# EAGLE design ESP07_Multi (EAGLE 7.3.0)
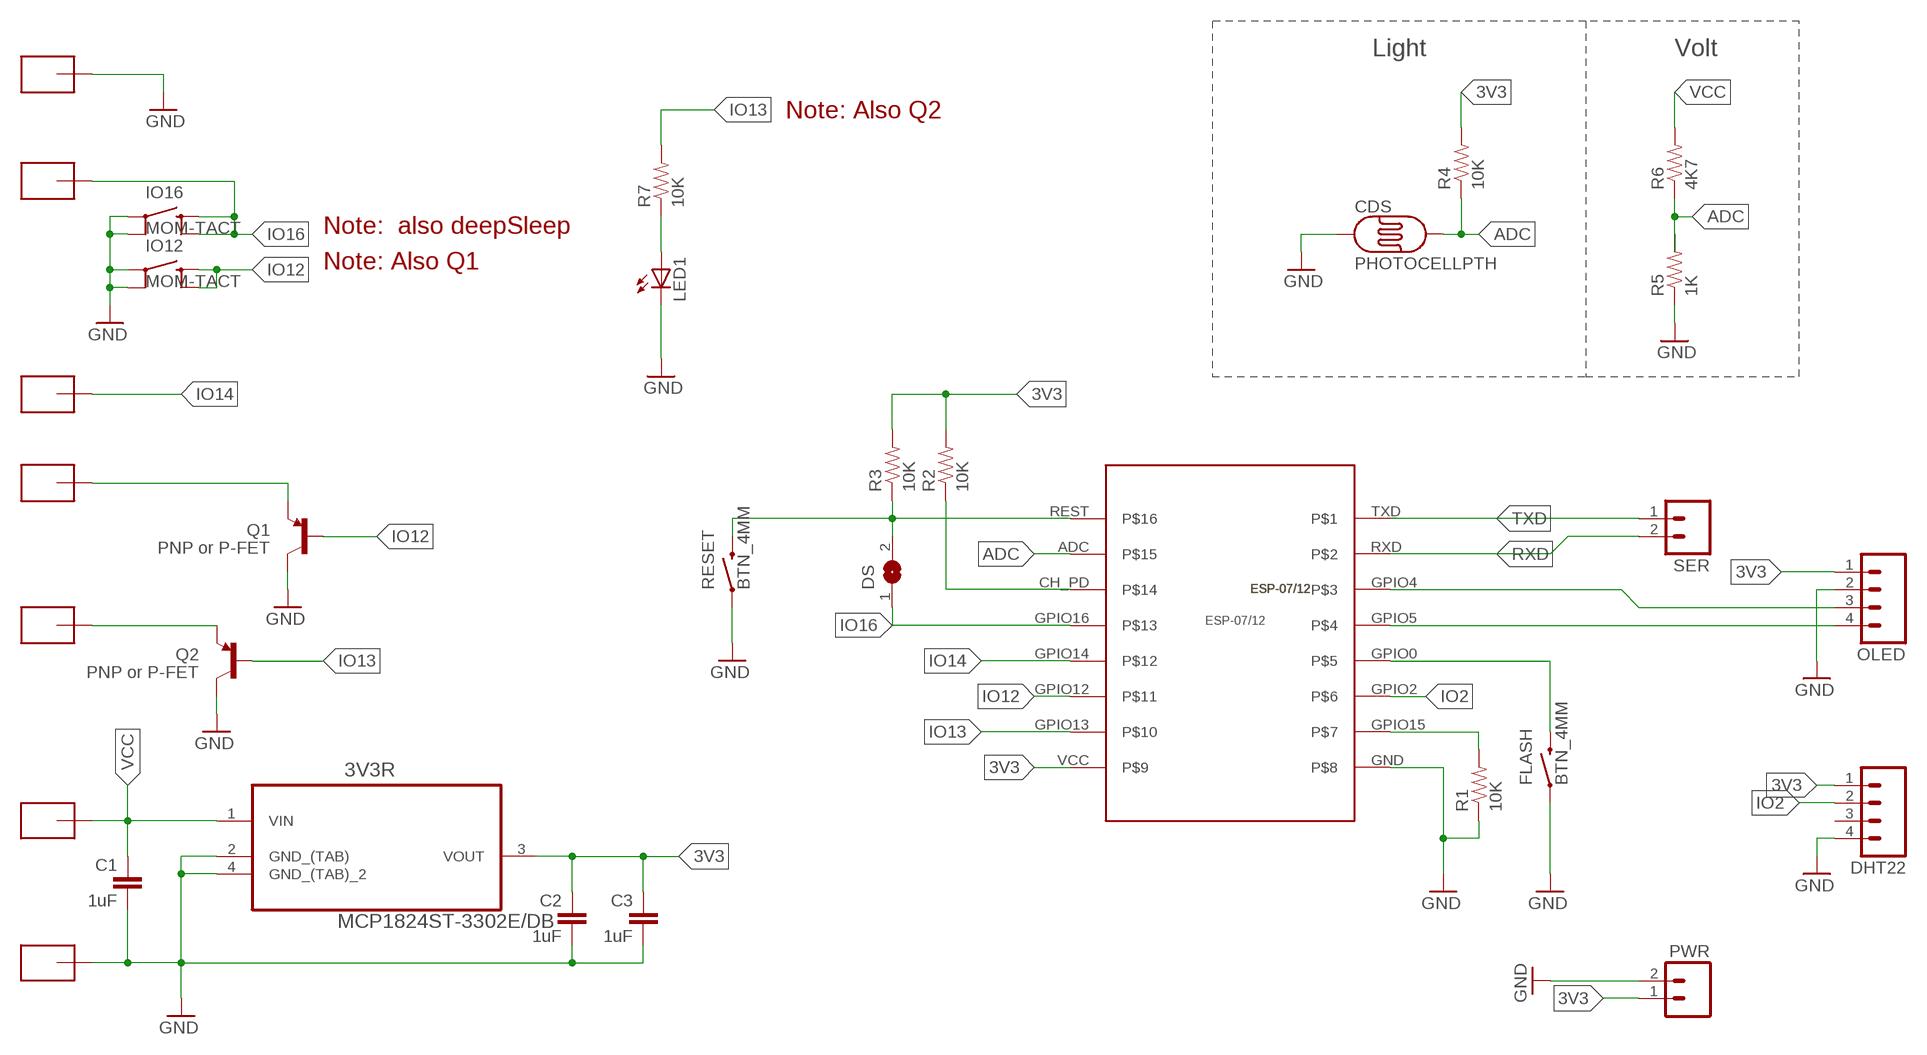
[diagram p0: schematic, sheet 1]

## Parts
3V3R  MCP1824ST-3302E/DB  [SOT230P700X180-4N]
C1  1uF  CAP  [0805-CAP]
C2  1uF  CAP  [0805-CAP]
C3  1uF  CAP  [0805-CAP]
CDS  PHOTOCELLPTH  [PHOTOCELL]
DHT22  M04PTH  [1X04]
DS  SJ  [SJ]
FLASH  BTN_4MM  [BTN_4MM]
IO12  MOM-TACT  [TACTILE-SMD]
IO16  MOM-TACT  [TACTILE-SMD]
LED1  LEDCHIPLED_0805  [CHIPLED_0805]
OLED  M04PTH  [1X04]
PWR  M02PTH  [1X02]
Q1  PNP or P-FET  TRANSISTOR_PNPSMD  [SOT23-3]
Q2  PNP or P-FET  TRANSISTOR_PNPSMD  [SOT23-3]
R1  10K  RESISTOR0805-RES  [0805]
R2  10K  RESISTOR0805-RES  [0805]
R3  10K  RESISTOR0805-RES  [0805]
R4  10K  RESISTOR0805-RES  [0805]
R5  1K  RESISTOR0805-RES  [0805]
R6  4K7  RESISTOR0805-RES  [0805]
R7  10K  RESISTOR0805-RES  [0805]
RESET  BTN_4MM  [BTN_4MM]
SER  M02PTH  [1X02]
U$1  ESP-07/12  [ESP-07/12]
U$2  SMD-PAD-SM  [SMD-PAD3]
U$3  SMD-PAD-SM  [SMD-PAD3]
U$4  SMD-PAD-SM  [SMD-PAD3]
U$5  SMD-PAD-SM  [SMD-PAD3]
U$6  SMD-PAD-SM  [SMD-PAD3]
U$7  SMD-PAD-SM  [SMD-PAD3]
U$8  SMD-PAD-SM  [SMD-PAD3]

## Nets
3V3: 3V3R.3(VOUT) C2.1 C3.1 DHT22.1 OLED.1 PWR.1 R2.2 R3.2 R4.2 U$1.VCC
ADC: CDS.2 R4.1 R5.2 R6.1 U$1.ADC
GND: 3V3R.2(GND_(TAB)) 3V3R.4(GND_(TAB)_2) C1.2 C2.2 C3.2 CDS.1 DHT22.4 FLASH.1 IO12.1 IO12.2 IO16.1 IO16.2 LED1.C OLED.2 PWR.2 Q1.3(C) Q2.3(C) R1.1 R5.1 RESET.1 U$1.GND U$2.P$1 U$5.P$1
IO2: DHT22.2 U$1.GPIO2
IO12: IO12.3 IO12.4 Q1.1(B) U$1.GPIO12
IO13: Q2.1(B) R7.2 U$1.GPIO13
IO14: U$1.GPIO14 U$4.P$1
IO16: DS.1 IO16.3 IO16.4 U$1.GPIO16 U$6.P$1
N$1: LED1.A R7.1
N$3: OLED.3 U$1.GPIO4
N$4: Q2.2(E) U$8.P$1
N$5: Q1.2(E) U$7.P$1
N$8: R1.2 U$1.GPIO15
N$9: OLED.4 U$1.GPIO5
N$10: FLASH.2 U$1.GPIO0
N$11: R2.1 U$1.CH_PD
N$22: DS.2 R3.1 RESET.2 U$1.REST
RXD: SER.2 U$1.RXD
TXD: SER.1 U$1.TXD
VCC: 3V3R.1(VIN) C1.1 R6.2 U$3.P$1
Unconnected: DHT22.3

## Notes on the sheet
- Light | Volt
- Note: Also Q2
- Note:  also deepSleep
- Note: Also Q1

## Library data of the parts
3V3R = Microchip_By_element14_Batch_1:MCP1824ST-3302E/DB: IC, LDO VOLT REG, 3.3V, 0.3A,; MPN: MCP1824ST-3302E/DB; OC_FARNELL: 1578379; OC_NEWARK: 05N1293; PACKAGE: SOT-223-3; SUPPLIER: Microchip
C1-C3 = SparkFun-Capacitors:CAP: Capacitor Standard 0603 ceramic capacitor, and 0.1" leaded capacitor.
CDS = SparkFun-Sensors:PHOTOCELL: CdS photoresistor. This is a low cost way to detect light levels. Resistance decreases with more incoming light. SparkFun SKU: SEN-09088
DHT22 OLED = SparkFun-Connectors:M04: Header 4 Standard 4-pin 0.1" header. Use with straight break away headers (SKU : PRT-00116), right angle break away headers (PRT-00553), swiss pins (PRT-00743), machine pins (PRT-00117), and female headers (PRT-00115). Molex polarized connector foot print use with SKU : PRT-08231 with associated crimp pins and housings. 1MM SMD Version SKU: PRT-10208
DS = jumper:SJ: SMD solder JUMPER
FLASH RESET = CuriousTech:BTN_4MM
IO12 IO16 = CuriousTech:MOM-TACT
LED1 = led:LED: LED OSRAM: - CHIPLED LG R971, LG N971, LY N971, LG Q971, LY Q971, LO R971, LY R971 LH N974, LH R974 LS Q976, LO Q976, LY Q976 LO Q996 - Hyper CHIPLED LW Q18S LB Q993, LB Q99A, LB R99A - SideLED LS A670, LO A670, LY A670, LG A670, LP A670 LB A673, LV A673, LT A673, LW A673 LH A674 LY A675 LS A676, LA A676, LO A676, LY A676, LW A676 LS A679, LY A679, LG A679 - Hyper Micro SIDELEDÂ® LS Y876, LA Y876, LO Y876, LY Y876 LT Y87S - SmartLED LW L88C, LW L88S LB L89C, LB L89S, LG L890 LS L89K, LO L89K, LY L89K LS L896, LA L896, LO L896, LY L896 - TOPLED LS T670, LO T670, LY T670, LG T670, LP T670 LSG T670, LSP T670, LSY T670, LOP T670, LYG T670 LG T671, LOG T671, LSG T671 LB T673, LV T673, LT T673, LW T673 LH T674 LS T676, LA T676, LO T676, LY T676, LB T676, LH T676, LSB T676, LW T676 LB T67C, LV T67C, LT T67C, LS T67K, LO T67K, LY T67K, LW E67C LS E67B, LA E67B, LO E67B, LY E67B, LB E67C, LV E67C, LT E67C LW T67C LS T679, LY T679, LG T679 LS T770, LO T770, LY T770, LG T770, LP T770 LB T773, LV T773, LT T773, LW T773 LH T774 LS E675, LA E675, LY E675, LS T675 LS T776, LA T776, LO T776, LY T776, LB T776 LHGB T686 LT T68C, LB T68C - Hyper Mini TOPLEDÂ® LB M676 - Mini TOPLED SantanaÂ® LG M470 LS M47K, LO M47K, LY M47K Source: http://www.osram.convergy.de LUXEON: - LUMILEDÂ® LXK2-PW12-R00, LXK2-PW12-S00, LXK2-PW14-U00, LXK2-PW14-V00 LXK2-PM12-R00, LXK2-PM12-S00, LXK2-PM14-U00 LXK2-PE12-Q00, LXK2-PE12-R00, LXK2-PE12-S00, LXK2-PE14-T00, LXK2-PE14-U00 LXK2-PB12-K00, LXK2-PB12-L00, LXK2-PB12-M00, LXK2-PB14-N00, LXK2-PB14-P00, LXK2-PB14-Q00 LXK2-PR12-L00, LXK2-PR12-M00, LXK2-PR14-Q00, LXK2-PR14-R00 LXK2-PD12-Q00, LXK2-PD12-R00, LXK2-PD12-S00 LXK2-PH12-R00, LXK2-PH12-S00 LXK2-PL12-P00, LXK2-PL12-Q00, LXK2-PL12-R00 Source: www.luxeon.com KINGBRIGHT: KA-3528ASYC Source: www.kingbright.com
PWR SER = SparkFun-Connectors:M02: Standard 2-pin 0.1" header. Use with - straight break away headers ( PRT-00116) - right angle break away headers (PRT-00553) - swiss pins (PRT-00743) - machine pins (PRT-00117) - female headers (PRT-00115) Molex polarized connector foot print use with: PRT-08233 with associated crimp pins and housings. 2.54_SCREWTERM for use with PRT-10571. 3.5mm Screw Terminal footprints for PRT-08084 5mm Screw Terminal footprints for use with PRT-08432
Q1 Q2 = SparkFun-DiscreteSemi:TRANSISTOR_PNP: Generic PNP BJT Double check pinouts against datasheets- not all devices are the same! MMBT3906 - 40V 200mA SOT-23 (TRANS-08052) MMBT4403 - 40V 600mA SOT-23 (TRANS-09245)
R1-R7 = SparkFun-Resistors:RESISTOR: Resistor Basic schematic elements and footprints for 0603, 1206, and PTH resistors.
U$1 = ESP-07_12:ESP-07/12: Version 1.0 of the library for the ESP-07/12 full GPIO dev board module byME Jon jonnyradu@gmail.com
U$2-U$8 = CuriousTech:SMD-PAD-SM: SMD-PAD

## Board
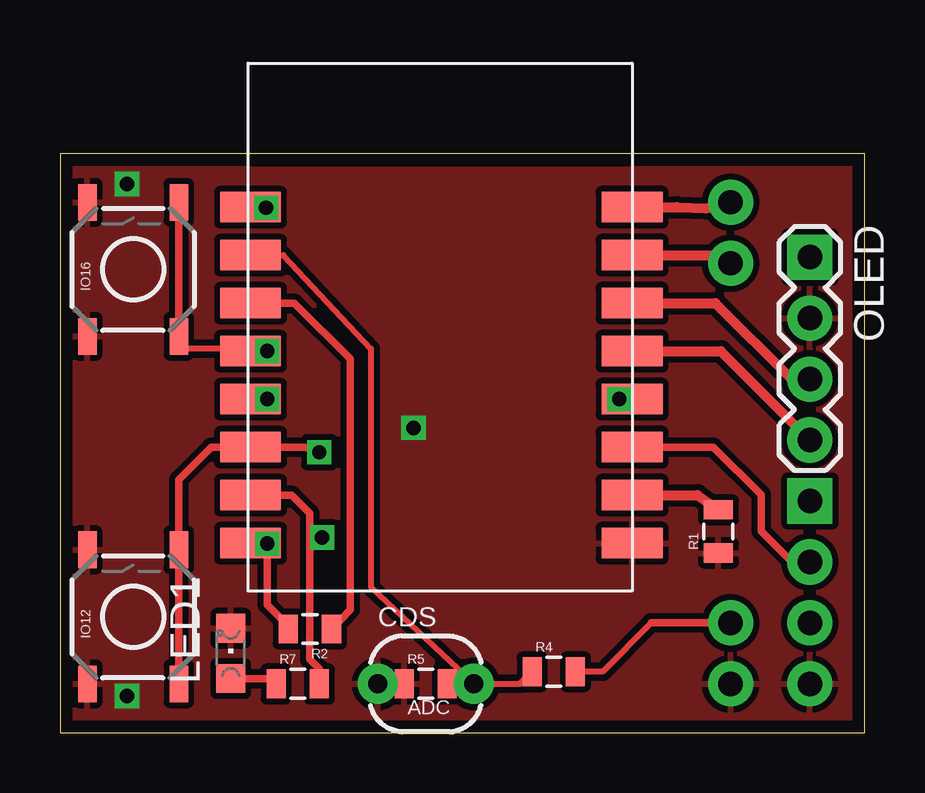
[diagram p1: board, top side]
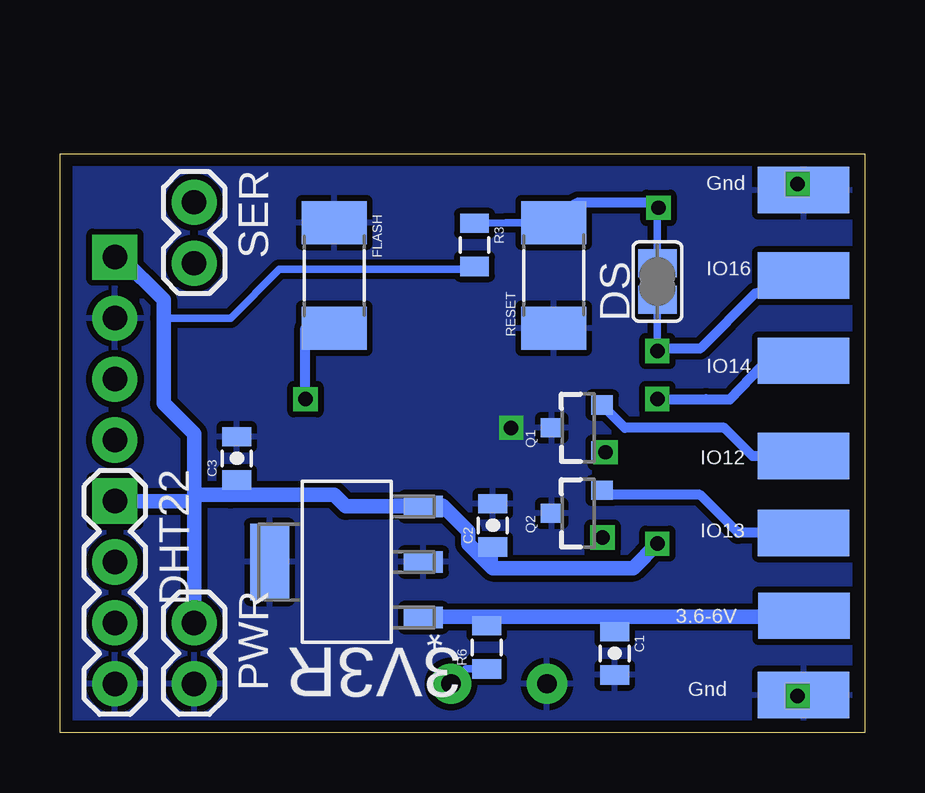
[diagram p2: board, bottom side, seen from below]

Size 33.53 x 24.13 mm. Coordinates in mm from the lower left corner, seen from the top.
Outline: 0,0 33.53,0 33.53,24.13 0,24.13 0,0
Copper layers (1*16): Top 0.035mm / dielectric 1.5mm / Bottom 0.035mm
Design rules "default *": minimum track width 10mil, minimum drill 24mil, track to track 8mil, track to pad 8mil, pad to pad 8mil, via to via 8mil, smd to smd 8mil, copper to edge 20mil, drill to drill 8mil, minimum pad ring 10mil, minimum via ring 8mil, stop-mask expansion 4mil, vias tented up to drill 0mil, thermal gap 10mil

### Footprints (pad centres in the part's own frame; a part is rotated, then mirrored left to right if it is on the bottom)
SOT230P700X180-4N = smd 1.626 x 0.889: 1 -3.2,2.311; 2 -3.2,0; 3 -3.2,-2.311 | smd 1.626 x 3.175: 4 3.2,0
0805-CAP = smd 0.8 x 1.2: 1 -0.9,0; 2 0.9,0
PHOTOCELL = drill 0.8 pad 1.676: 1 -2,0; 2 2,0
1X04 = drill 1.016 pad 1.88 square: 1 0,0 | drill 1.016 pad 1.88: 2 2.54,0; 3 5.08,0; 4 7.62,0
SJ = smd 1.168 x 1.6: 1 -0.762,0; 2 0.762,0
BTN_4MM = smd 1.8 x 2.7: 1 -2.2,0; 2 2.2,0
TACTILE-SMD = smd 1.524 x 0.762: 1 -2.794,1.905; 2 2.794,1.905; 3 -2.794,-1.905; 4 2.794,-1.905
CHIPLED_0805 = smd 1.2 x 1.2: A 0,-1.05; C 0,1.05
1X02 = drill 1.016 pad 1.88: 1 0,0; 2 2.54,0
SOT23-3 = smd 0.8 x 0.9: 1 -0.95,-1; 2 0.95,-1; 3 0,1.1
0805 = smd 0.8 x 1.2: 1 -0.9,0; 2 0.9,0
ESP-07/12 = smd 2.54 x 1.27: ADC 0.1,14; CH_PD 0.1,12; GND 16,2; GPIO0 16,8; GPIO2 16,6; GPIO4 16,12; GPIO5 16,10; GPIO12 0.1,6; GPIO13 0.1,4; GPIO14 0.1,8; GPIO15 16,4; GPIO16 0.1,10; REST 0.1,16; RXD 16,14; TXD 16,16; VCC 0.1,2
SMD-PAD3 = smd 3.81 x 1.93: P$1 0,0

### Placement (x,y rotation side)
3V3R  21.59,7.11 180 bottom
C1  10.41,3.3 270 bottom
C2  15.49,8.64 90 bottom
C3  26.16,11.43 90 bottom
CDS  15.24,2.03 0 top
DHT22  31.24,9.65 270 bottom
DS  8.64,18.8 90 bottom
FLASH  22.1,19.05 270 bottom
IO12  3.05,4.83 90 top
IO16  3.05,19.3 90 top
LED1  7.11,3.3 0 top
OLED  31.24,19.81 270 top
PWR  27.94,4.57 270 bottom
Q1  11.94,12.7 90 bottom
Q2  11.94,9.14 90 bottom
R1  27.43,8.38 90 top
R2  10.41,4.32 180 top
R3  16.26,20.32 270 bottom
R4  20.57,2.54 0 top
R5  15.24,2.03 0 top
R6  15.75,3.56 90 bottom
R7  9.91,2.03 0 top
RESET  12.95,19.05 90 bottom
SER  27.94,22.1 270 bottom
U$1  7.84,5.9 0 top
U$2  2.55,1.57 0 bottom
U$3  2.52,4.87 0 bottom
U$4  2.54,15.49 0 bottom
U$5  2.54,22.61 0 bottom
U$6  2.54,19.05 0 bottom
U$7  2.54,11.52 0 bottom
U$8  2.54,8.32 0 bottom

### Tracks (layer width: path | path; a pad name or v marks a point on that pad's centre or on a via)
3V3  (via drill 0.6)
  Top 0.254: 24.64,4.57 22.61,2.54 R4.2
  Top 0.305: R2.2 9.28,4.69 8.64,5.33 v8.64,7.87 | 24.64,4.57 PWR.1
  Top 0.61: v8.64,7.87 7.96,7.87 U$1.VCC
  Bottom 0.305: R3.2 16.37,19.42 16.76,19.3 24.38,19.3 26.42,17.27 29.21,17.27 | C3.1 26.42,10.53 26.42,9.91
  Bottom 0.406: 17.59,9.46 17.55,9.42 | C2.1 15.49,6.86
  Bottom 0.61: OLED.1 30.99,19.81 29.21,18.03 29.21,17.27 29.21,13.72 27.94,12.45 27.94,9.91 | DHT22.1 27.94,9.65 | 27.94,9.65 27.94,9.91 | 27.94,9.91 26.42,9.91 22.1,9.91 21.61,9.42 3V3R.3 17.55,9.42 16.51,8.38 16.51,7.87 15.49,6.86 9.65,6.86 v8.64,7.87 | 17.59,9.46 19.56,9.46 | PWR.1 27.94,9.65
ADC
  Top 0.254: R4.1 19.17,2.03 CDS.2 12.95,6.06 12.95,16 9.31,19.9 U$1.ADC
  Top 0.305: R5.2 CDS.2
  Bottom 0.305: R6.1 16.62,2.66 CDS.2
GND  (via drill 0.6)
  Bottom 0.305: U$5.P$1 v2.79,22.86
  other vias: 2.79,1.52 14.73,12.7
  pour Top (isolate 0.254): 0,24.13 33.53,24.13 33.53,0 0,0
  pour Bottom (isolate 0.254): 0,0 0,24.13 33.53,24.13 33.53,0
IO2
  Top 0.305: U$1.GPIO2 27.22,11.9 29.21,9.91 29.21,8.38 30.48,7.11 DHT22.2
IO12  (via drill 0.6)
  Top 0.305: IO12.3 IO12.4 4.95,10.54 6.31,11.9 U$1.GPIO12 10.2,11.9 v10.8,11.68
  Bottom 0.305: 10.87,11.68 10.94,11.68 Q1.1
  Bottom 0.406: v10.8,11.68 10.87,11.68
IO13  (via drill 0.6)
  Top 0.305: 7.87,9.9 U$1.GPIO13 9.66,9.9 10.41,9.14 10.41,8.18 | R7.2 10.81,2.66 10.41,3.05 10.41,8.18 | 10.41,8.18 10.87,8.18 v10.92,8.13
  Bottom 0.305: v10.92,8.13 10.92,8.18 Q2.1
IO14  (via drill 0.6)
  Top 0.406: v8.64,13.9 7.87,13.97 U$1.GPIO14
  Bottom 0.406: U$4.P$1 4.32,15.24 5.6,13.89 6.61,13.9 v8.64,13.9
IO16  (via drill 0.6)
  Top 0.254: 7.84,16 5.21,16
  Top 0.305: IO16.4 IO16.3 5.21,16
  Top 0.406: 8.86,15.9 U$1.GPIO16 7.84,16 7.87,16 v8.64,15.9
  Bottom 0.305: DS.1 v8.64,15.9
  Bottom 0.406: U$6.P$1 4.57,18.29 6.86,16 8.51,16 v8.64,15.9
N$1
  Top 0.305: LED1.A 8.79,2.25 R7.1
N$3
  Top 0.406: U$1.GPIO4 27.31,17.9 30.48,14.73 OLED.3
N$4
  Bottom 0.406: U$8.P$1 5.27,8.32 6.86,9.91 10.75,9.91 Q2.2
N$5
  Bottom 0.406: U$7.P$1 4.67,11.52 5.84,12.7 9.99,12.7 Q1.2
N$8
  Top 0.406: 22.86,9.9 22.95,9.9 22.95,9.73 23.71,9.76 23.71,9.9 U$1.GPIO15 26.56,9.9 R1.2
N$9
  Top 0.406: U$1.GPIO5 27.53,15.9 OLED.4
N$10  (via drill 0.6)
  Top 0.305: v23.3,13.89 23.51,14.22 U$1.GPIO0
  Bottom 0.406: v23.3,13.89 23.3,16.85 FLASH.2
N$11
  Top 0.305: U$1.CH_PD 9.76,17.9 12.09,15.58 12.09,5.11 R2.1
  Top 0.406: 7.94,17.84 U$1.CH_PD
N$22  (via drill 0.6)
  Top 0.406: v8.59,21.87 8.14,21.81 8.14,21.9 U$1.REST | U$1.REST 8.86,21.9 | U$1.REST 7.84,21.9
  Bottom 0.305: DS.2 8.64,21.82 v8.59,21.87 | 13.55,21.25 14.96,21.25 R3.1
  Bottom 0.406: v8.59,21.87 8.82,22.1 11.94,22.1 13.55,21.25 RESET.2
RXD
  Top 0.406: U$1.RXD 27.52,19.9 SER.2
TXD
  Top 0.406: U$1.TXD 25.71,21.9 26.92,21.84 SER.1
VCC
  Bottom 0.305: 4.25,4.83 2.82,4.83 U$3.P$1 | R6.2 15.75,4.83
  Bottom 0.61: 10.41,4.83 15.75,4.83 18.39,4.83 3V3R.1 | 10.41,4.83 4.25,4.83 | C1.1 10.41,4.83

### Text on the board
tPlace: ADC
bPlace: Gnd | IO16 | IO14 | IO12 | IO13 | 3.6-6V | Gnd
tStop: Multipurpose | ESP-07/12 | CuriousTech.net